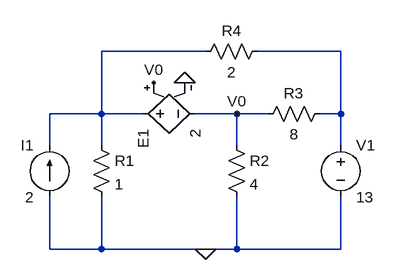
[diagram p0: schematic Draft22.asc]
Draft22.asc, the LTspice schematic file:
Version 4
SHEET 1 880 680
WIRE 192 48 32 48
WIRE 400 48 272 48
WIRE 32 144 32 48
WIRE 32 144 -48 144
WIRE 96 144 32 144
WIRE 240 144 176 144
WIRE 288 144 240 144
WIRE 400 144 400 48
WIRE 400 144 368 144
WIRE -48 192 -48 144
WIRE 32 192 32 144
WIRE 240 192 240 144
WIRE 400 192 400 144
WIRE -48 352 -48 272
WIRE 32 352 32 272
WIRE 32 352 -48 352
WIRE 192 352 32 352
WIRE 240 352 240 272
WIRE 240 352 192 352
WIRE 400 352 400 272
WIRE 400 352 240 352
FLAG 192 352 0
FLAG 160 96 0
FLAG 240 144 V0
FLAG 112 96 V0
SYMBOL current -48 272 R180
WINDOW 0 24 80 Left 2
WINDOW 3 24 0 Left 2
SYMATTR InstName I1
SYMATTR Value 2
SYMBOL res 16 176 R0
SYMATTR InstName R1
SYMATTR Value 1
SYMBOL res 224 176 R0
SYMATTR InstName R2
SYMATTR Value 4
SYMBOL res 384 128 R90
WINDOW 0 0 56 VBottom 2
WINDOW 3 32 56 VTop 2
SYMATTR InstName R3
SYMATTR Value 8
SYMBOL voltage 400 176 R0
SYMATTR InstName V1
SYMATTR Value 13
SYMBOL res 288 32 R90
WINDOW 0 0 56 VBottom 2
WINDOW 3 32 56 VTop 2
SYMATTR InstName R4
SYMATTR Value 2
SYMBOL e 80 144 M90
SYMATTR InstName E1
SYMATTR Value 2

The netlist it stands for:
* Draft22.asc
I1 0 N001 2
R1 N001 0 1
R2 V0 0 4
R3 N002 V0 8
V1 N002 0 13
R4 N002 N001 2
E1 N001 V0 V0 0 2
.backanno
.end